# EAGLE schematic twister (EAGLE 6.5.0)
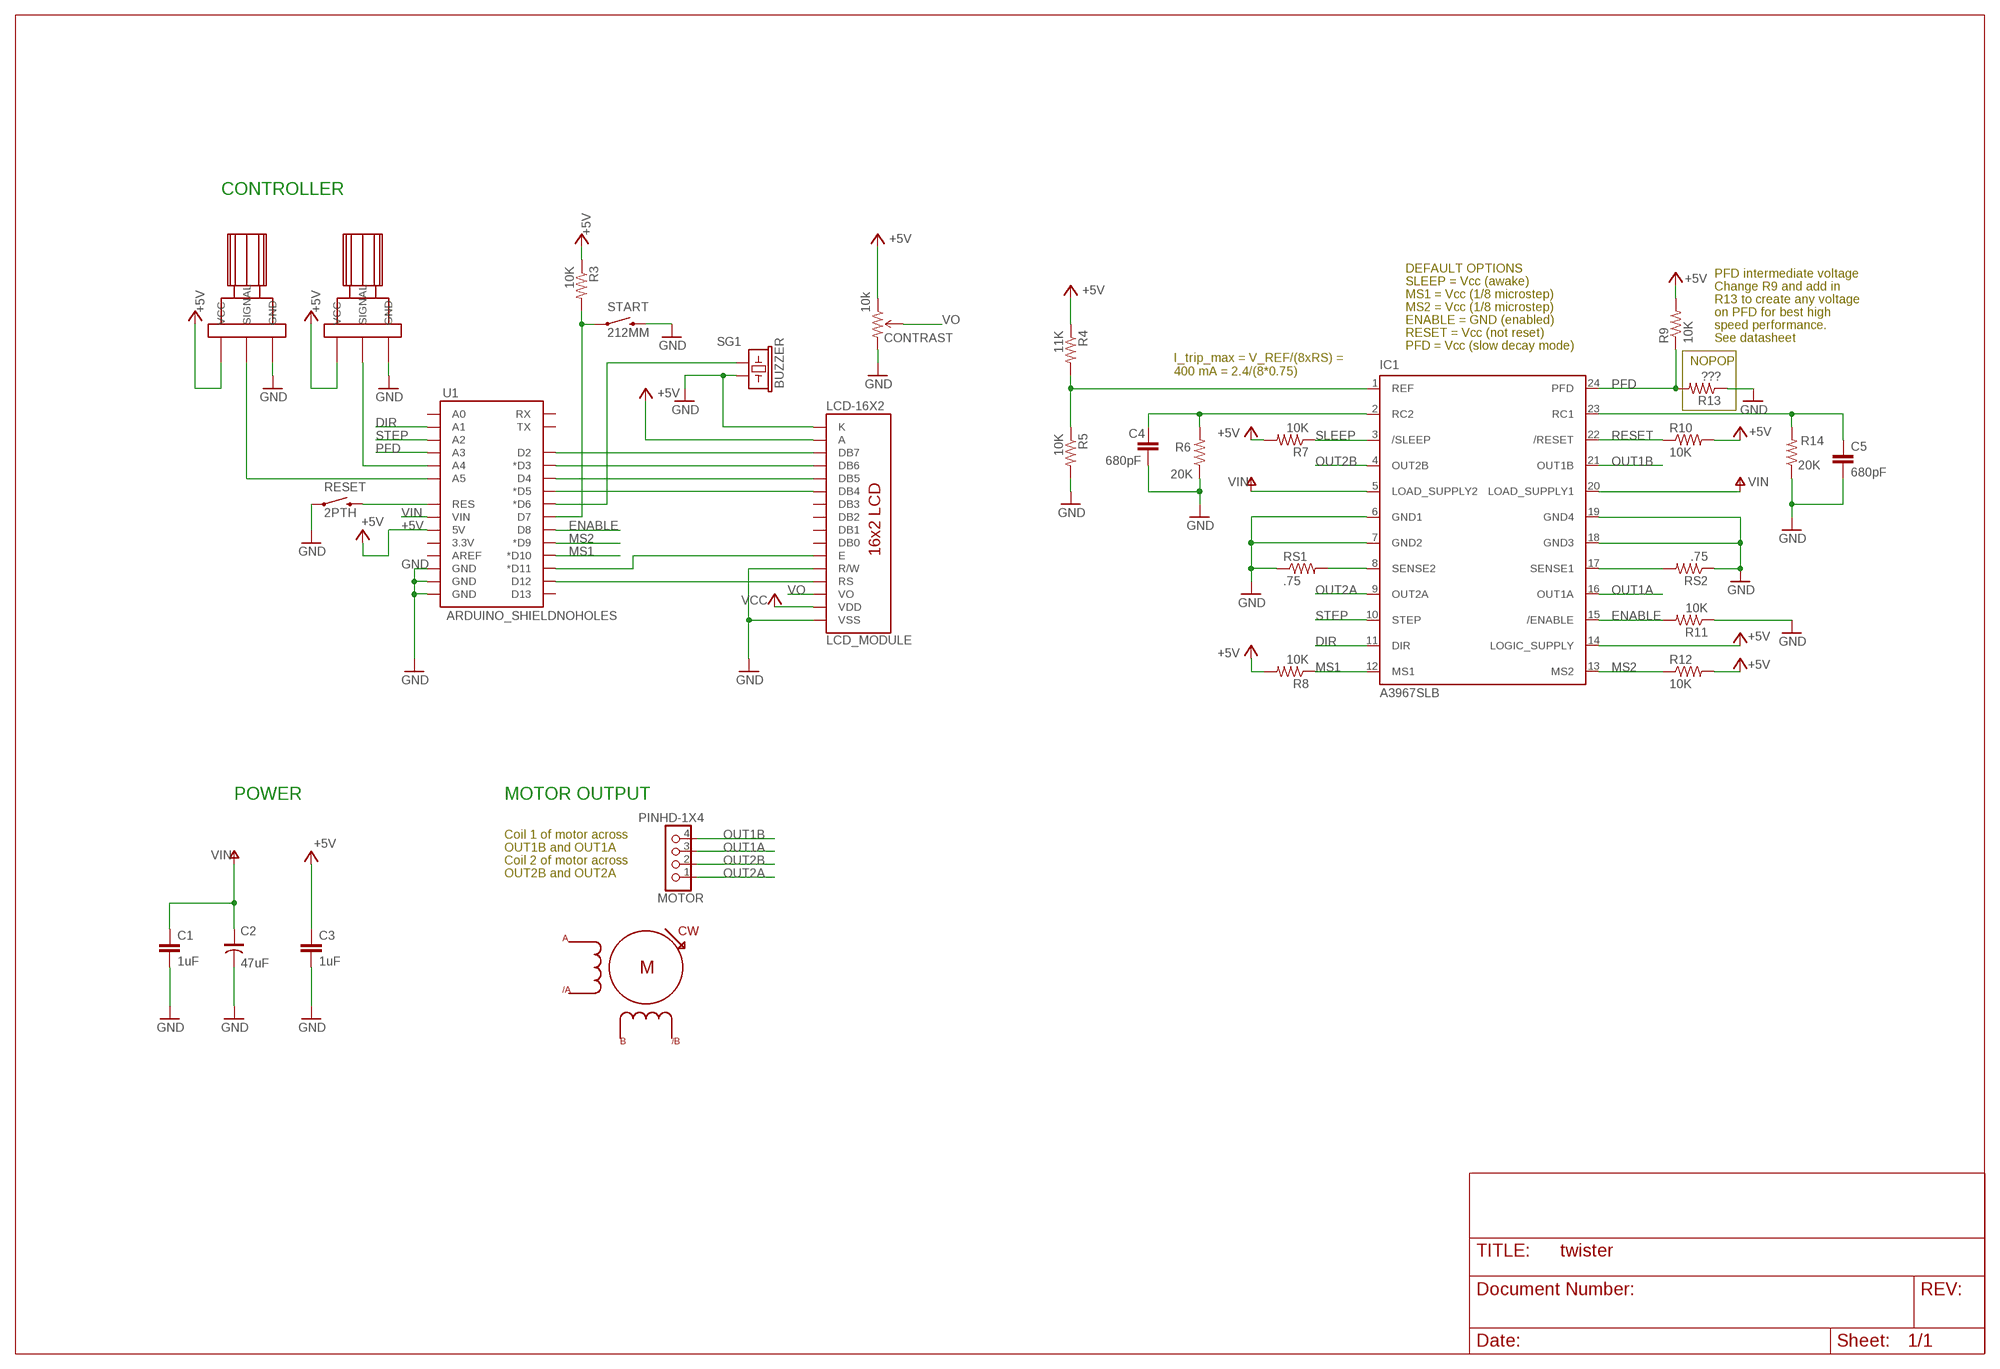
[diagram p0: schematic, sheet 1]

## Parts
BUZZER  SG1  BUZZERPTH  [BUZZER-12MM]
C1  1uF  C_0805  [0805]
C2  47uF  C-POL_0807  [153CLV-0807]
C3  1uF  C_0805  [0805]
C4  680pF  C_0603  [0603]
C5  680pF  C_0603  [0603]
CONTRAST  10k  TRIMPOT  [3362U-2]
IC1  A3967SLB  [SO24W]
LCD_MODULE  LCD-16X2  [LCD-16X2]
MOTOR  PINHD-1X4  [1X04]
R1  R12-0  LARGE_POT  [LARGE_POT]
R2  R12-0  LARGE_POT  [LARGE_POT]
R3  10K  R_0603  [0603]
R4  11K  R_0603  [0603]
R5  10K  R_0603  [0603]
R6  20K  R_0603  [0603]
R7  10K  R_0603  [0603]
R8  10K  R_0603  [0603]
R9  10K  R_0603  [0603]
R10  10K  R_0603  [0603]
R11  10K  R_0603  [0603]
R12  10K  R_0603  [0603]
R13  ???  R_0603  [0603]
R14  20K  R_0603  [0603]
RESET  2PTH  SWITCH-MOMENTARY-2PTH  [TACTILE-PTH]
RS1  .75  R_1206  [1206]
RS2  .75  R_1206  [1206]
START  212MM  SWITCH-MOMENTARY-212MM  [TACTILE-PTH-12MM]
STEPPER  ST-PM35  STEPPER_ST-PM35  [ST-PM35-15-11C]
U1  ARDUINO_SHIELDNOHOLES  [DUEMILANOVE_SHIELD_NOHOLES]

## Nets
+5V: C3.1 CONTRAST.1(CCW) IC1.14(LOGIC_SUPPLY) LCD_MODULE.2(VDD) LCD_MODULE.15(A) R1.LEFT(VCC) R2.LEFT(VCC) R3.1 R4.1 R7.2 R8.2 R9.2 R10.2 R12.2 U1.5V ; supply symbol labelled VCC
D6: BUZZER.- U1.D6(*D6)
DIR: IC1.11(DIR) U1.A1
ENABLE: IC1.15(/ENABLE) R11.2 U1.D8
GND: BUZZER.+ C1.2 C2.- C3.2 C4.2 C5.2 CONTRAST.3(CW) IC1.6(GND1) IC1.7(GND2) IC1.18(GND3) IC1.19(GND4) LCD_MODULE.1(VSS) LCD_MODULE.5(R/W) LCD_MODULE.16(K) R1.RIGHT(GND) R2.RIGHT(GND) R5.2 R6.1 R11.1 R13.1 R14.1 RESET.1 RS1.1 RS2.1 START.3 U1.GND@0(GND) U1.GND@1(GND) U1.GND@2(GND)
MS1: IC1.12(MS1) R8.1 U1.D10(*D10)
MS2: IC1.13(MS2) R12.1 U1.D9(*D9)
N$1: IC1.8(SENSE2) RS1.2
N$2: C4.1 IC1.2(RC2) R6.2
N$3: IC1.17(SENSE1) RS2.2
N$4: LCD_MODULE.4(RS) U1.D12
N$5: LCD_MODULE.6(E) U1.D11(*D11)
N$6: LCD_MODULE.11(DB4) U1.D5(*D5)
N$7: LCD_MODULE.12(DB5) U1.D4
N$8: LCD_MODULE.13(DB6) U1.D3(*D3)
N$9: LCD_MODULE.14(DB7) U1.D2
N$10: R2.CENTER(SIGNAL) U1.A4
N$11: R1.CENTER(SIGNAL) U1.A5
N$12: R3.2 START.1 U1.D7
N$13: C5.1 IC1.23(RC1) R14.2
N$14: IC1.1(REF) R4.2 R5.1
OUT1A: IC1.16(OUT1A) MOTOR.3
OUT1B: IC1.21(OUT1B) MOTOR.4
OUT2A: IC1.9(OUT2A) MOTOR.1
OUT2B: IC1.4(OUT2B) MOTOR.2
PFD: IC1.24(PFD) R9.1 R13.2 U1.A3
RESET: IC1.22(/RESET) R10.1 RESET.3 U1.RES
SLEEP: IC1.3(/SLEEP) R7.1
STEP: IC1.10(STEP) U1.A2
VIN: C1.1 C2.+ IC1.5(LOAD_SUPPLY2) IC1.20(LOAD_SUPPLY1) U1.VIN
VO: CONTRAST.2(WIPER) LCD_MODULE.3(VO)
Unconnected: LCD_MODULE.7(DB0) LCD_MODULE.8(DB1) LCD_MODULE.9(DB2) LCD_MODULE.10(DB3) U1.3.3V U1.A0 U1.AREF U1.D13 U1.RX U1.TX

## Notes on the sheet
- CONTROLLER
- DEFAULT OPTIONS
- PFD intermediate voltage
- SLEEP = Vcc (awake)
- Change R9 and add in
- MS1 = Vcc (1/8 microstep)
- R13 to create any voltage
- MS2 = Vcc (1/8 microstep)
- on PFD for best high
- ENABLE = GND (enabled)
- speed performance.
- RESET = Vcc (not reset)
- See datasheet
- PFD = Vcc (slow decay mode)
- NOPOP
- I_trip_max = V_REF/(8xRS) = 
  400 mA = 2.4/(8*0.75)
- POWER | MOTOR OUTPUT
- Coil 1 of motor across
- OUT1B and OUT1A
- Coil 2 of motor across
- OUT2B and OUT2A

## Library data of the parts
BUZZER = twister_clean:BUZZER: Buzzer 12mm Spark Fun Electronics SKU : Comp-Buzzer
C1 C3 = twister_clean:C: Capacitor; MN: TDK Corp.; PARTNO: C2012X5R1Cxxxxxxx; VID: DK
C2 = cyclops:C-POL: Polarized Capacitor
C4 C5 = twister_clean:C: Capacitor
CONTRAST = twister_clean:TRIMPOT
IC1 = twister_clean:A3967SLB: ANALOG DEVICES
LCD_MODULE = twister_clean:LCD-16X2
MOTOR = twister_clean:PINHD-1X4
R1 R2 = twister_clean:LARGE_POT
R3-R14 = twister_clean:R: Resistor; DK: PxxxxHTR-ND; MN: Panasonic; MPN: ERJ-3EKFxxxxV
RESET START = twister_clean:SWITCH-MOMENTARY-2
RS1 RS2 = twister_clean:R: Resistor
STEPPER = twister:STEPPER
U1 = twister_clean:ARDUINO_SHIELD